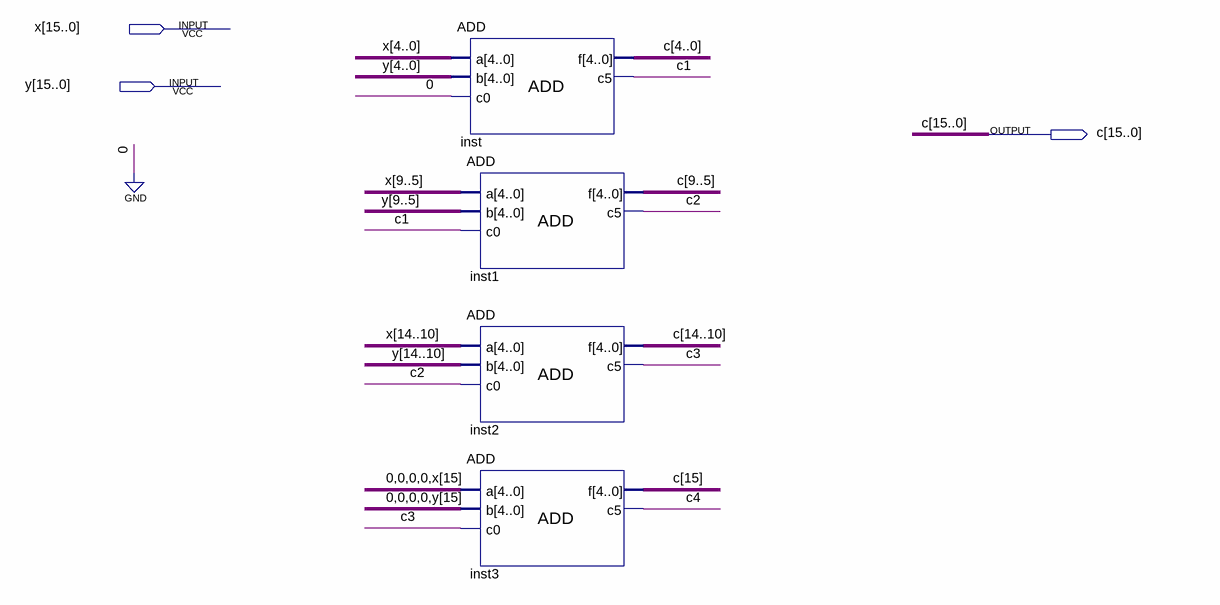
[diagram p0: schematic sheet]
// Quartus schematic ADD16.bdf as structural Verilog: 4 symbols, 3 pins
module ADD16 (
  input  [15:0] x,
  input  [15:0] y,
  output [15:0] c
);

  ADD inst (.a(x[4:0]), .b(y[4:0]), .c0(1'b0), .f(c[4:0]), .c5(c[1]));
  ADD inst1 (.a(x[9:5]), .b(y[9:5]), .c0(c[1]), .f(c[9:5]), .c5(c[2]));
  ADD inst2 (.a(x[14:10]), .b(y[14:10]), .c0(c[2]), .f(c[14:10]), .c5(c[3]));
  ADD inst3 (.a({4'b0000, x[15]}), .b({4'b0000, y[15]}), .c0(c[3]), .f(c[15]), .c5(c[4]));
endmodule
